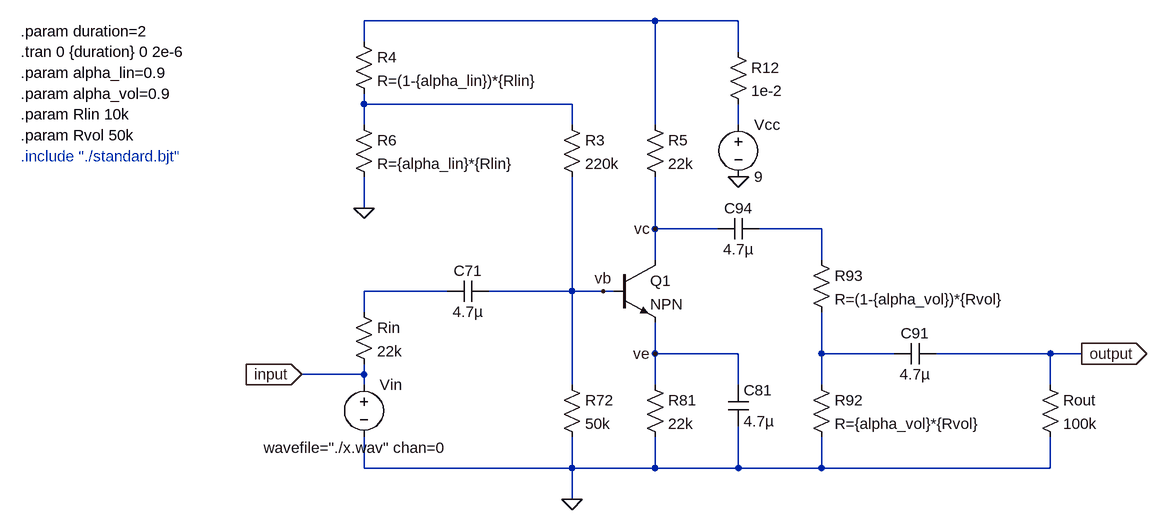
[diagram p0: schematic Fuzz.asc]
Fuzz.asc, the LTspice schematic file:
Version 4
SHEET 1 3724 836
WIRE 1152 -784 704 -784
WIRE 1280 -784 1152 -784
WIRE 704 -752 704 -784
WIRE 1280 -736 1280 -784
WIRE 704 -656 704 -672
WIRE 1024 -656 704 -656
WIRE 704 -624 704 -656
WIRE 1024 -624 1024 -656
WIRE 1152 -624 1152 -784
WIRE 1280 -624 1280 -656
WIRE 704 -496 704 -544
WIRE 1152 -464 1152 -544
WIRE 1248 -464 1152 -464
WIRE 1408 -464 1312 -464
WIRE 1152 -416 1152 -464
WIRE 1408 -416 1408 -464
WIRE 832 -368 704 -368
WIRE 1024 -368 1024 -544
WIRE 1024 -368 896 -368
WIRE 1072 -368 1024 -368
WIRE 1088 -368 1072 -368
WIRE 704 -336 704 -368
WIRE 1152 -272 1152 -320
WIRE 1280 -272 1152 -272
WIRE 1408 -272 1408 -336
WIRE 1520 -272 1408 -272
WIRE 1760 -272 1584 -272
WIRE 1808 -272 1760 -272
WIRE 704 -240 704 -256
WIRE 704 -240 608 -240
WIRE 704 -224 704 -240
WIRE 1024 -224 1024 -368
WIRE 1152 -224 1152 -272
WIRE 1280 -224 1280 -272
WIRE 1408 -224 1408 -272
WIRE 1760 -224 1760 -272
WIRE 704 -96 704 -144
WIRE 1024 -96 1024 -144
WIRE 1024 -96 704 -96
WIRE 1152 -96 1152 -144
WIRE 1152 -96 1024 -96
WIRE 1280 -96 1280 -160
WIRE 1280 -96 1152 -96
WIRE 1408 -96 1408 -144
WIRE 1408 -96 1280 -96
WIRE 1760 -96 1760 -144
WIRE 1760 -96 1408 -96
WIRE 1024 -48 1024 -96
FLAG 1280 -544 0
FLAG 1024 -48 0
FLAG 1808 -272 output
IOPIN 1808 -272 Out
FLAG 704 -496 0
FLAG 608 -240 input
IOPIN 608 -240 In
FLAG 1072 -368 vb
FLAG 1152 -464 vc
FLAG 1152 -272 ve
SYMBOL res 1136 -640 R0
SYMATTR InstName R5
SYMATTR Value 22k
SYMBOL res 1008 -640 R0
SYMATTR InstName R3
SYMATTR Value 220k
SYMBOL voltage 1280 -640 R0
WINDOW 123 0 0 Left 0
WINDOW 39 0 0 Left 0
SYMATTR InstName Vcc
SYMATTR Value 9
SYMBOL res 1136 -240 R0
SYMATTR InstName R81
SYMATTR Value 22k
SYMBOL res 1392 -240 R0
SYMATTR InstName R92
SYMATTR Value R={alpha_vol}*{Rvol}
SYMBOL res 1008 -240 R0
SYMATTR InstName R72
SYMATTR Value 50k
SYMBOL voltage 704 -240 R0
WINDOW 123 0 0 Left 0
WINDOW 39 0 0 Left 0
WINDOW 3 -154 113 Left 2
SYMATTR Value wavefile="./x.wav" chan=0
SYMATTR InstName Vin
SYMBOL res 1744 -240 R0
SYMATTR InstName Rout
SYMATTR Value 100k
SYMBOL res 1392 -432 R0
SYMATTR InstName R93
SYMATTR Value R=(1-{alpha_vol})*{Rvol}
SYMBOL res 688 -768 R0
SYMATTR InstName R4
SYMATTR Value R=(1-{alpha_lin})*{Rlin}
SYMBOL res 688 -640 R0
SYMATTR InstName R6
SYMATTR Value R={alpha_lin}*{Rlin}
SYMBOL res 688 -352 R0
SYMATTR InstName Rin
SYMATTR Value 22k
SYMBOL cap 896 -384 R90
WINDOW 0 0 32 VBottom 2
WINDOW 3 32 32 VTop 2
SYMATTR InstName C71
SYMATTR Value 4.7µ
SYMBOL cap 1312 -480 R90
WINDOW 0 0 32 VBottom 2
WINDOW 3 32 32 VTop 2
SYMATTR InstName C94
SYMATTR Value 4.7µ
SYMBOL cap 1264 -224 R0
SYMATTR InstName C81
SYMATTR Value 4.7µ
SYMBOL cap 1584 -288 R90
WINDOW 0 0 32 VBottom 2
WINDOW 3 32 32 VTop 2
SYMATTR InstName C91
SYMATTR Value 4.7µ
SYMBOL res 1264 -752 R0
SYMATTR InstName R12
SYMATTR Value 1e-2
SYMBOL npn 1088 -416 R0
SYMATTR InstName Q1
TEXT 176 -736 Left 2 !.tran 0 {duration} 0 2e-6
TEXT 176 -640 Left 2 !.param Rlin 10k
TEXT 176 -576 Left 2 ;.include "./standard.bjt"
TEXT 176 -608 Left 2 !.param Rvol 50k
TEXT 176 -704 Left 2 !.param alpha_lin=0.9
TEXT 176 -672 Left 2 !.param alpha_vol=0.9
TEXT 176 -768 Left 2 !.param duration=2

The netlist it stands for:
* Fuzz.asc
R5 N001 vc 22k
R3 N002 vb 220k
Vcc N003 0 9
R81 ve 0 22k
R92 N006 0 R={alpha_vol}*{Rvol}
R72 vb 0 50k
Vin input 0 wavefile="./x.wav" chan=0
Rout output 0 100k
R93 N004 N006 R=(1-{alpha_vol})*{Rvol}
R4 N001 N002 R=(1-{alpha_lin})*{Rlin}
R6 N002 0 R={alpha_lin}*{Rlin}
Rin N005 input 22k
C71 vb N005 4.7µ
C94 N004 vc 4.7µ
C81 ve 0 4.7µ
C91 output N006 4.7µ
R12 N001 N003 1e-2
Q1 vc vb ve 0 NPN
.model NPN NPN
.model PNP PNP
.lib standard.bjt
.tran 0 {duration} 0 2e-6
.param Rlin 10k
* .include "./standard.bjt"
.param Rvol 50k
.param alpha_lin=0.9
.param alpha_vol=0.9
.param duration=2
.backanno
.end